# Altium schematic sheet RF.SchDoc
size A
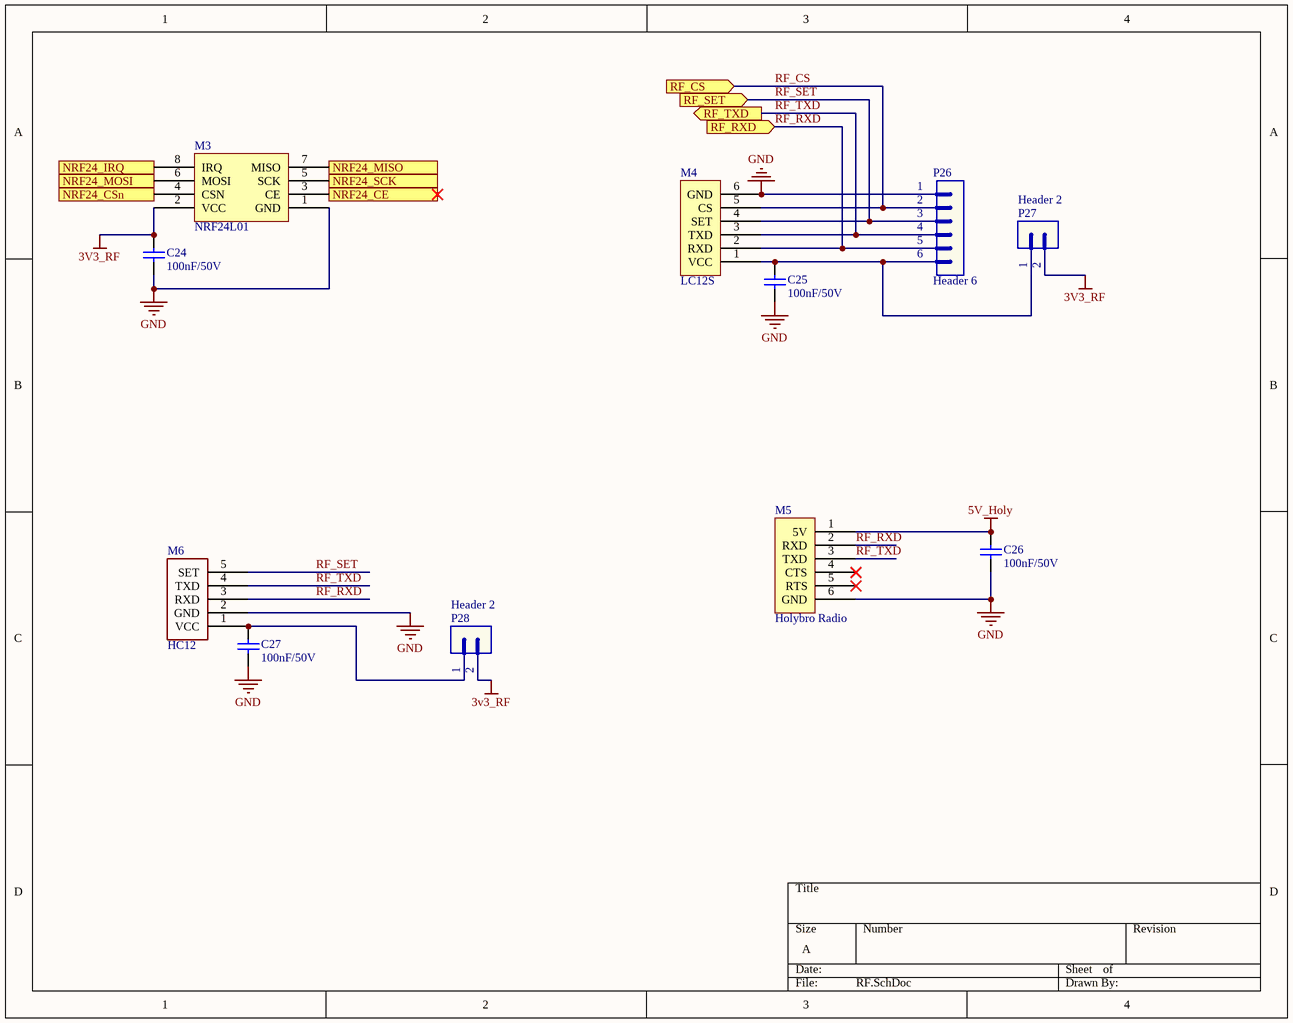
[diagram p0: RF.SchDoc]

## Parts
C24  value 100nF/50V  [CAP-SM-0805]  (hidden comment: Cap-1nF-50V-0805)
C25  value 100nF/50V  [CAP-SM-0805]  (hidden comment: Cap-1nF-50V-0805)
C26  value 100nF/50V  [CAP-SM-0805]  (hidden comment: Cap-1nF-50V-0805)
C27  value 100nF/50V  [CAP-SM-0805]  (hidden comment: Cap-1nF-50V-0805)
M3  NRF24L01  [NRF24L01]
M4  LC12S  [LC12S]
M5  Holybro Radio  [Holybro]
M6  HC12  [HC12]
P26  Header 6  [JP6]
P27  Header 2  [JP2]
P28  Header 2  [JP2]

## Ports
NRF24_CE (in), NRF24_CSn (in), NRF24_IRQ (out), NRF24_MISO (out), NRF24_MOSI (in), NRF24_SCK (in), RF_CS (in), RF_RXD (in), RF_SET (in), RF_TXD (out)

## Nets
3V3_RF: C24.2 M3.2(VCC) P27.2 P28.2
5V_Holy: C26.2 M5.1(5V)
GND: C24.1 C25.1 C26.1 C27.1 M3.1(GND) M4.6(GND) M5.6(GND) M6.2(GND) P26.1
NRF24_CE: M3.3(CE) ; port NRF24_CE
NRF24_CSn: M3.4(CSN) ; port NRF24_CSn
NRF24_IRQ: M3.8(IRQ) ; port NRF24_IRQ
NRF24_MISO: M3.7(MISO) ; port NRF24_MISO
NRF24_MOSI: M3.6(MOSI) ; port NRF24_MOSI
NRF24_SCK: M3.5(SCK) ; port NRF24_SCK
RF_CS: M4.5(CS) P26.2 ; port RF_CS
RF_RXD: M4.2(RXD) M5.2(RXD) M6.3(RXD) P26.5 ; port RF_RXD
RF_SET: M4.4(SET) M6.5(SET) P26.3 ; port RF_SET
RF_TXD: M4.3(TXD) M5.3(TXD) M6.4(TXD) P26.4 ; port RF_TXD
NetC25_2: C25.2 M4.1(VCC) P26.6 P27.1
NetC27_2: C27.2 M6.1(VCC) P28.1

Not connected (* = marked no-connect by the designer): M5 4(CTS)* 5(RTS)*

## Library data of the parts
C24-C27 = Cap-1nF-50V-0805: CAP CER 1000PF 100V X7R 0805; Manufacturer: Johanson Dielectrics Inc.; Manufacturer Part Number: 101X15W102MV4E; Local Supplier: thegioiic; Local Supplier Link: https://thegioiic.com/products/tu-1nf-50v-0805; Supplier 1: Digikey; Supplier 1 Link: https://www.digikey.com/product-detail/en/johanson-dielectrics-inc/101X15W102MV4E/709-1335-1-ND/2327235; Supplier 1 Part Number: 709-1335-1-ND
M3 = NRF24L01: Local supply: Hshop; Local supply link: https://lastminuteengineers.com/nrf24l01-arduino-wireless-communication/
M4 = LC12S: Local supply: HShop; Local supply link: https://hshop.vn/products/mach-thu-phat-rf-uart-lc12s-2-4ghz
M5 = Holybro: Supplier: https://www.lazada.vn/products/ld-holybro-433mhz-915-mhz-500-mw-thu-phat-vo-tuyen-xa-bo-v3-cho-pixhawk-4-dieu-khien-chuyen-bay-i430804435-s768474304.html?spm=a2o4n.searchlist.list.4.25396b19yIS9XO&search=1
M6 = HC12: Local supply: Hshop; Local supply number: HS000897; Local supply link: https://hshop.vn/products/mach-thu-phat-rf-uart-si4463-433mhzkhoang-coch-1km
P26 = Header 6: Header, 6-Pin; LatestRevisionDate: 17-Jul-2002; LatestRevisionNote: Re-released for DXP Platform.; Publisher: Altium Limited
P27 P28 = Header 2: Header, 2-Pin; LatestRevisionDate: 17-Jul-2002; LatestRevisionNote: Re-released for DXP Platform.; Publisher: Altium Limited